# EAGLE schematic master (EAGLE 6.4)
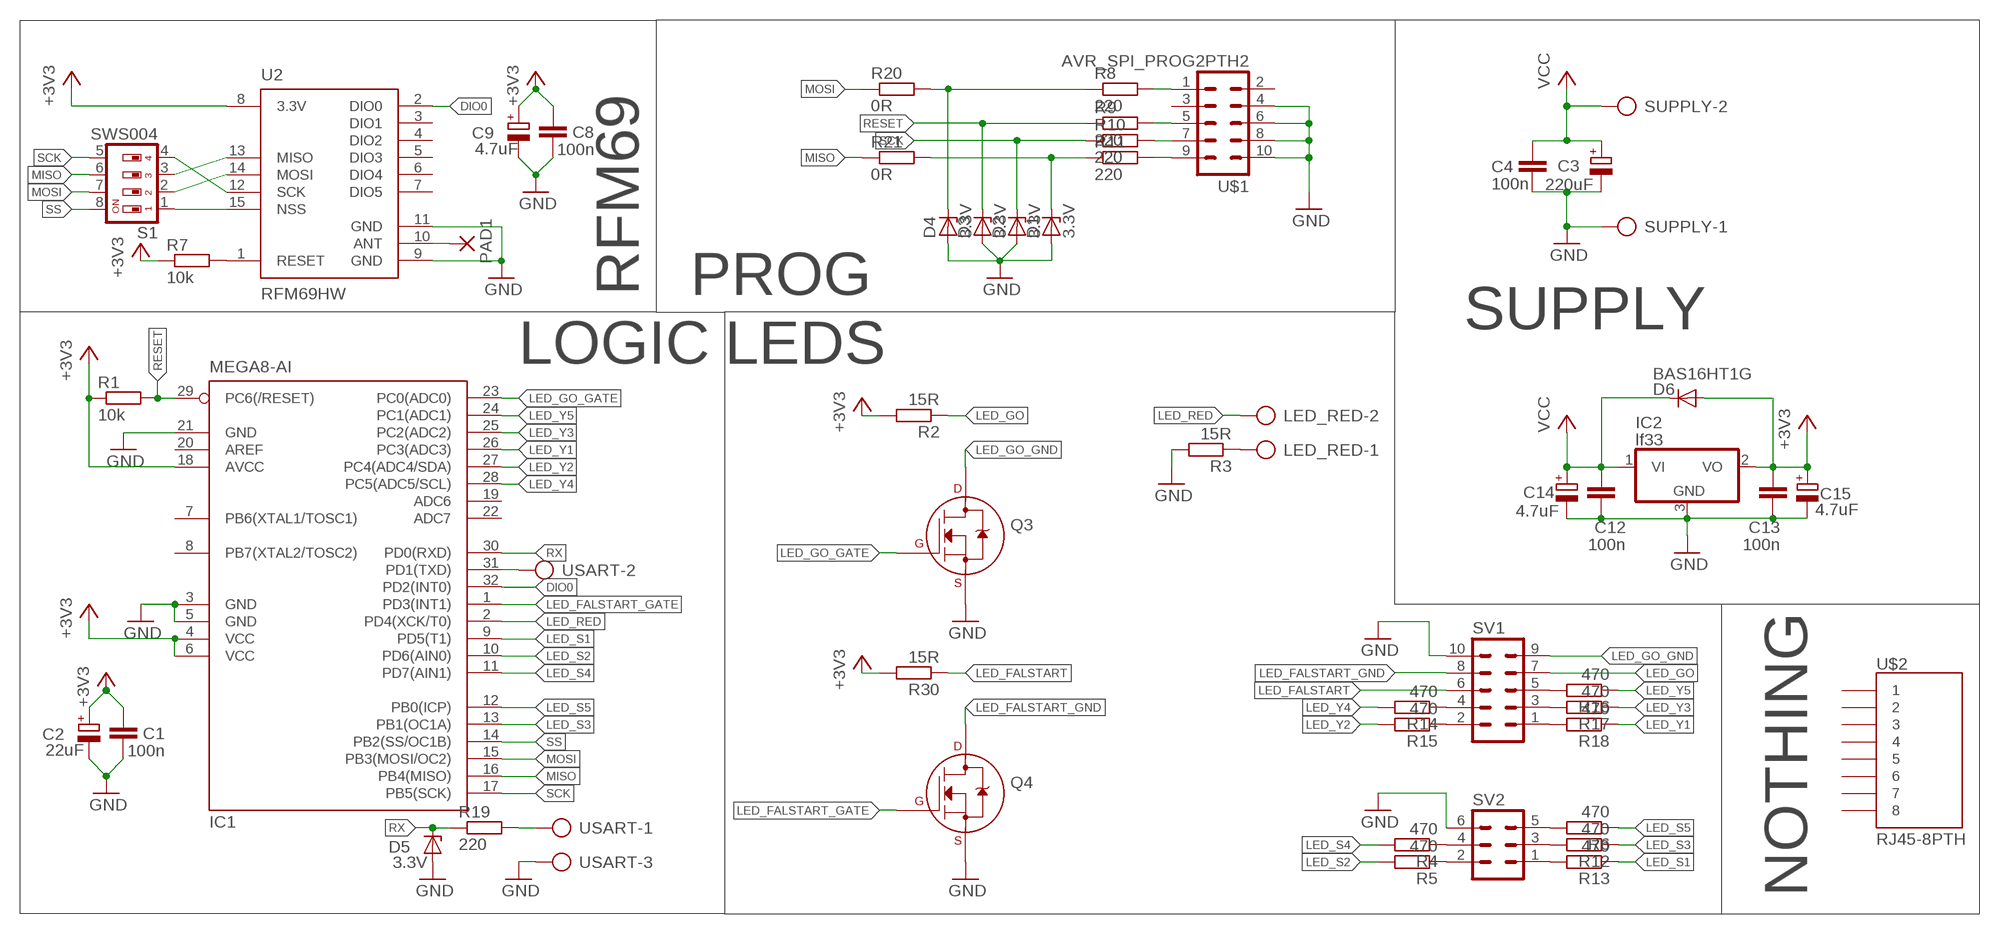
[diagram p0: schematic, sheet 1]

## Parts
C1  100n  C-EUC0805  [C0805]
C2  22uF  CPOL-EUE2-5  [E2-5]
C3  220uF  CPOL-EUE2-5  [E2-5]
C4  100n  C-EUC0805  [C0805]
C8  100n  C-EUC0805  [C0805]
C9  4.7uF  CPOL-EUE2-5  [E2-5]
C12  100n  C-EUC0805  [C0805]
C13  100n  C-EUC0805  [C0805]
C14  4.7uF  CPOL-EUE2-5  [E2-5]
C15  4.7uF  CPOL-EUE2-5  [E2-5]
D1  3.3V  ZENER-DIODESOD80C  [SOD80C]
D2  3.3V  ZENER-DIODESOD80C  [SOD80C]
D3  3.3V  ZENER-DIODESOD80C  [SOD80C]
D4  3.3V  ZENER-DIODESOD80C  [SOD80C]
D5  3.3V  ZENER-DIODESOD80C  [SOD80C]
D6  BAS16HT1G  DIODE-DO214AC  [DO214AC]
IC1  MEGA8-AI  [TQFP32-08]
IC2  lf33  7806DT  [TO252]
LED_RED  AK500/2  [AK500/2]
PAD1  WIREPADSMD5-2,5  [5-2,5]
Q3  2N7000_SOT23  [SOT-23]
Q4  2N7000_SOT23  [SOT-23]
R1  10k  R-EU_R0805  [R0805]
R2  15R  R-EU_R0805  [R0805]
R3  15R  R-EU_R0805  [R0805]
R4  470  R-EU_R0805  [R0805]
R5  470  R-EU_R0805  [R0805]
R6  470  R-EU_R0805  [R0805]
R7  10k  R-EU_R0805  [R0805]
R8  220  R-EU_R0805  [R0805]
R9  220  R-EU_R0805  [R0805]
R10  220  R-EU_R0805  [R0805]
R11  220  R-EU_R0805  [R0805]
R12  470  R-EU_R0805  [R0805]
R13  470  R-EU_R0805  [R0805]
R14  470  R-EU_R0805  [R0805]
R15  470  R-EU_R0805  [R0805]
R16  470  R-EU_R0805  [R0805]
R17  470  R-EU_R0805  [R0805]
R18  470  R-EU_R0805  [R0805]
R19  220  R-EU_R0805  [R0805]
R20  0R  R-EU_R1206  [R1206]
R21  0R  R-EU_R1206  [R1206]
R30  15R  R-EU_R0805  [R0805]
S1  SWS004  [SMS-004]
SUPPLY  AK500/2  [AK500/2]
SV1  ML10  [ML10]
SV2  ML6  [ML6]
U2  RFM69HW  [RFM69W-XXXS2]
U$1  AVR_SPI_PROG2PTH2  ML10L  [ML10L]
U$2  RJ45-8PTH  [RJ45-8]
USART  AK500/3  [AK500/3]

## Nets
+3V3: C1.1 C2.+ C8.1 C9.+ C13.1 C15.+ D6.A IC1.4(VCC) IC1.6(VCC) IC1.18(AVCC) IC2.2(VO) R1.1 R2.2 R7.1 R30.2 U2.8(3.3V)
DIO0: IC1.32(PD2(INT0)) U2.2(DIO0)
GND: C1.2 C2.- C3.- C4.2 C8.2 C9.- C12.2 C13.2 C14.- C15.- D1.A D2.A D3.A D4.A D5.A IC1.3(GND) IC1.5(GND) IC1.21(GND) IC2.3(GND) Q3.2(S) Q4.2(S) R3.2 SUPPLY.1 SV1.10 SV2.6 U2.9(GND) U2.11(GND) U$1.4 U$1.6 U$1.8 U$1.10 USART.3
LED_FALSTART: R30.1 SV1.6
LED_FALSTART_GATE: IC1.1(PD3(INT1)) Q4.1(G)
LED_FALSTART_GND: Q4.3(D) SV1.8
LED_GO: R2.1 SV1.7
LED_GO_GATE: IC1.23(PC0(ADC0)) Q3.1(G)
LED_GO_GND: Q3.3(D) SV1.9
LED_RED: IC1.2(PD4(XCK/T0)) LED_RED.2
LED_S1: IC1.9(PD5(T1)) R13.1
LED_S2: IC1.10(PD6(AIN0)) R5.2
LED_S3: IC1.13(PB1(OC1A)) R12.1
LED_S4: IC1.11(PD7(AIN1)) R4.2
LED_S5: IC1.12(PB0(ICP)) R6.1
LED_Y1: IC1.26(PC3(ADC3)) R18.1
LED_Y2: IC1.27(PC4(ADC4/SDA)) R15.2
LED_Y3: IC1.25(PC2(ADC2)) R17.1
LED_Y4: IC1.28(PC5(ADC5/SCL)) R14.2
LED_Y5: IC1.24(PC1(ADC1)) R16.1
MISO: IC1.16(PB4(MISO)) R21.1 S1.6
MOSI: IC1.15(PB3(MOSI/OC2)) R20.1 S1.7
N$1: D1.C R11.1 R21.2
N$2: D4.C R8.1 R20.2
N$3: LED_RED.1 R3.1
N$4: R4.1 SV2.4
N$5: R5.1 SV2.2
N$6: R6.2 SV2.5
N$7: R7.2 U2.1(RESET)
N$8: S1.1 U2.15(NSS)
N$9: PAD1.1(P) U2.10(ANT)
N$10: S1.4 U2.12(SCK)
N$11: S1.3 U2.13(MISO)
N$12: S1.2 U2.14(MOSI)
N$13: R8.2 U$1.1
N$14: R11.2 U$1.9
N$15: R10.2 U$1.7
N$16: R9.2 U$1.5
N$19: R12.2 SV2.3
N$20: R13.2 SV2.1
N$21: R14.1 SV1.4
N$22: R15.1 SV1.2
N$23: R16.2 SV1.5
N$24: R17.2 SV1.3
N$25: R18.2 SV1.1
N$26: R19.2 USART.1
RESET: D3.C IC1.29(PC6(/RESET)) R1.2 R9.1
RX: D5.C IC1.30(PD0(RXD)) R19.1
SCK: D2.C IC1.17(PB5(SCK)) R10.1 S1.5
SS: IC1.14(PB2(SS/OC1B)) S1.8
TXD: IC1.31(PD1(TXD)) USART.2
VCC: C3.+ C4.1 C12.1 C14.+ D6.C IC2.1(VI) SUPPLY.2
Unconnected: IC1.7(PB6(XTAL1/TOSC1)) IC1.8(PB7(XTAL2/TOSC2)) IC1.19(ADC6) IC1.20(AREF) IC1.22(ADC7) U2.3(DIO1) U2.4(DIO2) U2.5(DIO3) U2.6(DIO4) U2.7(DIO5) U$1.2 U$1.3 U$2.1 U$2.2 U$2.3 U$2.4 U$2.5 U$2.6 U$2.7 U$2.8

## Notes on the sheet
- RFM69 | PROG
- SUPPLY
- LOGIC | LEDS
- NOTHING

## Library data of the parts
C1 C4 C8 C12 C13 = rcl:C-EU: CAPACITOR, European symbol
C2 C3 C9 C14 C15 = rcl:CPOL-EU: POLARIZED CAPACITOR, European symbol
D1-D5 = diode:ZENER-DIODE: Z-Diode
D6 = diode:DIODE-: DIODE
IC1 = atmel:MEGA8: MICROCONTROLLER 8 Kbytes FLASH, 1 kbytes SRAM, 512 bytes EEPROM, USART, 6-channel 10 bit ADC, 2-channel 8 bit ADC Pin compatible with Atmega48, ATMega88, ATMega168 Source: avr.lbr; MPN: ATMEGA8-16AU; OC_FARNELL: 9171371; OC_NEWARK: 73M8863
IC2 = linear:78*: Positive VOLTAGE REGULATOR Source: http://cache.national.com/ds/LM/LM78L05.pdf http://www.fairchildsemi.com/ds/LM/LM7805.pdf
LED_RED SUPPLY = con-ptr500:AK500/2: CONNECTOR; OC_FARNELL: unknown; OC_NEWARK: unknown
PAD1 = wirepad:WIREPAD: Wire PAD connect wire on PCB
Q3 Q4 = transistors:2N700*: 2N7000, 2N7002, NDS7002A N-channel enhancement mode MOSFET
R1-R21 R30 = rcl:R-EU_: RESISTOR, European symbol
S1 = smd-special:SWS004: SMD Dip Switch 4 pol.
SV1 U$1 = con-harting-ml:ML10: HARTING; OC_FARNELL: unknown; OC_NEWARK: unknown
SV2 = con-harting-ml:ML6: HARTING; OC_FARNELL: unknown; OC_NEWARK: unknown
U2 = SparkFun-RF:RFM69H
U$2 = SparkFun:RJ45-8: RJ45 Jack Simple RJ45, 8-pin connection - connector for common Cat5, Cat5e, and Cat6 Ethernet cables. Footprint not yet proven in production. Connector sku is PRT-00643; Breakout PCB sku is BOB-00716.
USART = con-ptr500:AK500/3: CONNECTOR; OC_FARNELL: unknown; OC_NEWARK: unknown